# Altium schematic sheet CONNECTOR_EXP.SchDoc
size A3; SheetNumber: 4; SheetTotal: 23
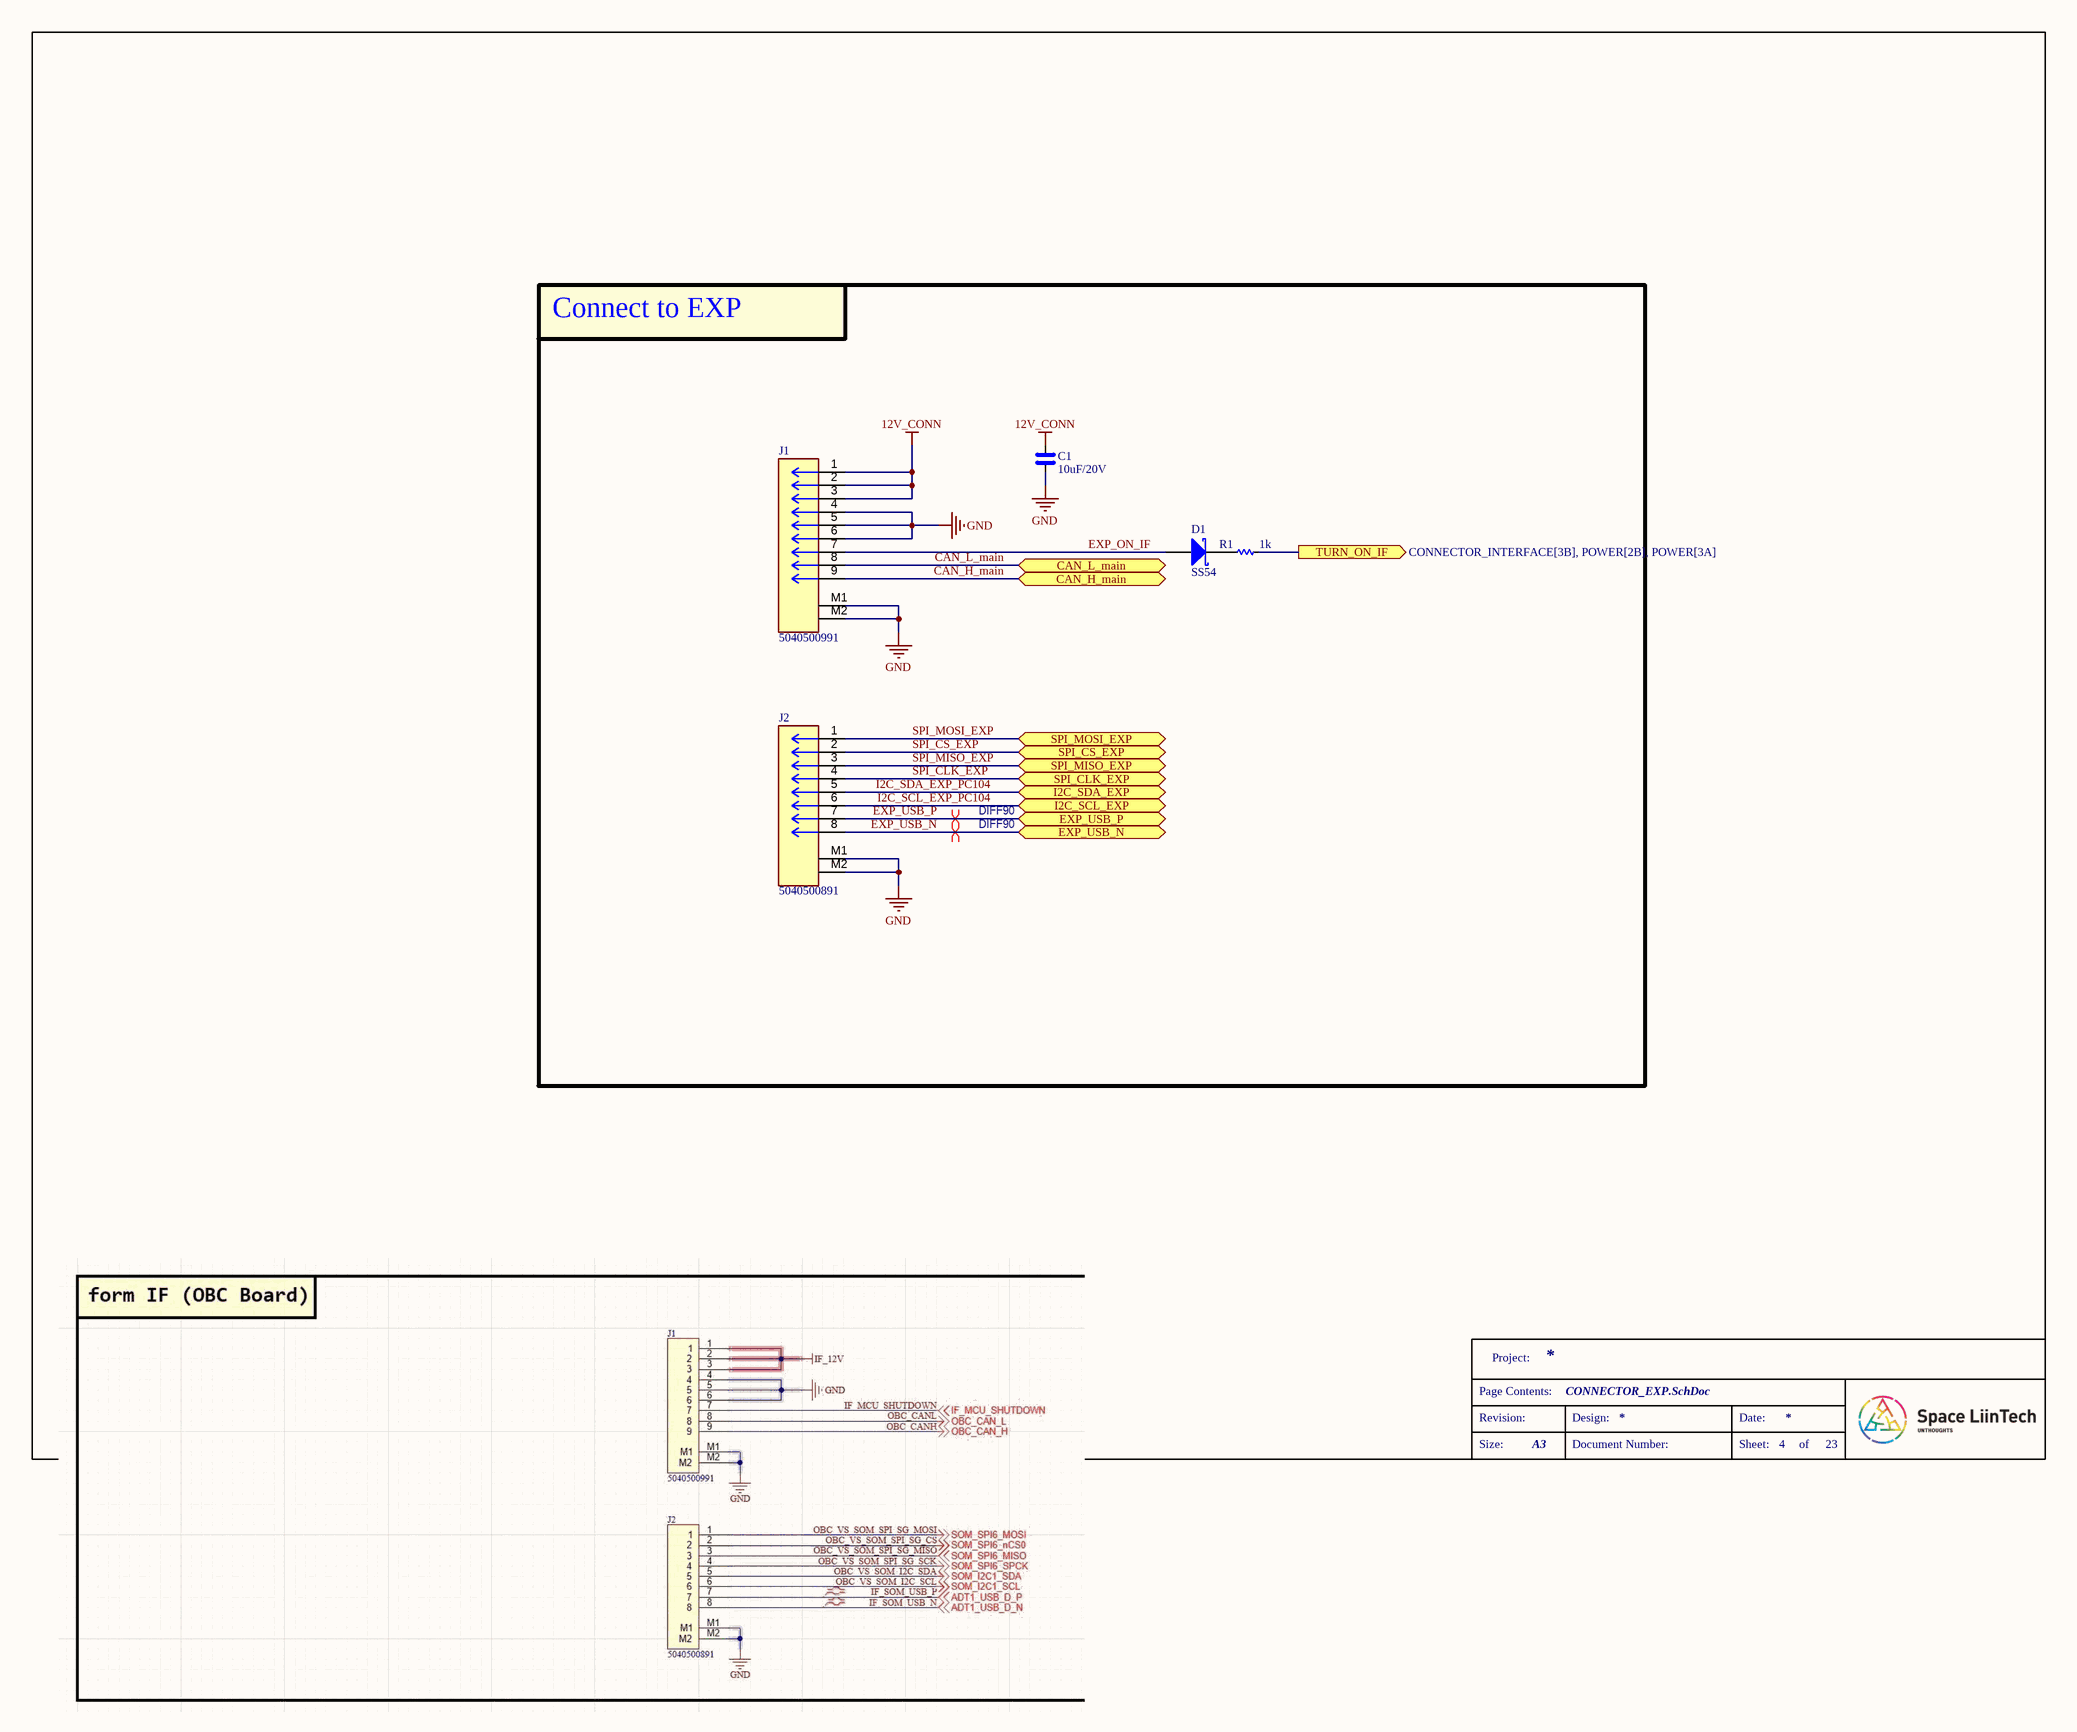
[diagram p0: CONNECTOR_EXP.SchDoc]

## Parts
C1  10uF/20V  [CAP_C_2012X110]
D1  SS54  [DO-214AC_SMA]
J1  5040500991  [MOLEX_5040500991]
J2  5040500891  [MOLEX_5040500891]
R1  1k  [RES_C_1005x30_L]

## Blocks framed on the sheet
Connect to EXP: C1 D1 J1 J2 R1

## Ports
CAN_H_main (bidir, see CAN_PHY[7A], CONNECTOR_INTERFACE[4A], CONNECTOR_INTERFACE[5C]), CAN_L_main (bidir, see CAN_PHY[7B], CONNECTOR_INTERFACE[4A], CONNECTOR_INTERFACE[7C]), EXP_USB_N (bidir, see CONNECTOR_INTERFACE[1C], SAMA7D65_MPU[4B]), EXP_USB_P (bidir, see CONNECTOR_INTERFACE[1C], SAMA7D65_MPU[4B]), I2C_SCL_EXP (bidir, see CONNECTOR_INTERFACE[1D], CONNECTOR_INTERFACE[6B], SAMA7D65_PIO[7A]), I2C_SDA_EXP (bidir, see CONNECTOR_INTERFACE[1C], CONNECTOR_INTERFACE[6B], SAMA7D65_PIO[7A]), SPI_CLK_EXP (bidir, see CONNECTOR_INTERFACE[3D], CONNECTOR_INTERFACE[4A]), SPI_CS_EXP (bidir, see CONNECTOR_INTERFACE[3C], CONNECTOR_INTERFACE[4A]), SPI_MISO_EXP (bidir, see CONNECTOR_INTERFACE[3D], CONNECTOR_INTERFACE[4A]), SPI_MOSI_EXP (bidir, see CONNECTOR_INTERFACE[3D], CONNECTOR_INTERFACE[4A]), TURN_ON_IF (out, see CONNECTOR_INTERFACE[3B], POWER[2B], POWER[3A])

## Nets
12V_CONN: C1.2 J1.1 J1.2 J1.3
GND: C1.1 J1.4 J1.5 J1.6 J1.M1 J1.M2 J2.M1 J2.M2
CAN_H_main: J1.9 ; port CAN_H_main
CAN_L_main: J1.8 ; port CAN_L_main
EXP_ON_IF: D1.1(A) J1.7
EXP_USB_N: J2.8 ; port EXP_USB_N
EXP_USB_P: J2.7 ; port EXP_USB_P
I2C_SCL_EXP_PC104: J2.6 ; port I2C_SCL_EXP
I2C_SDA_EXP_PC104: J2.5 ; port I2C_SDA_EXP
SPI_CLK_EXP: J2.4 ; port SPI_CLK_EXP
SPI_CS_EXP: J2.2 ; port SPI_CS_EXP
SPI_MISO_EXP: J2.3 ; port SPI_MISO_EXP
SPI_MOSI_EXP: J2.1 ; port SPI_MOSI_EXP
TURN_ON_IF: R1.2 ; port TURN_ON_IF
NetD1_2: D1.2(K) R1.1

## Layout directives
differential pair; differential pair class DIFF90; net class DIFF90; rule Matched Net Lengths [Tolerance = 4mil]: EXP_USB_N, EXP_USB_P

## Notes on the sheet
- Project:
- Page Contents:
- Revision:
- Design:
- Date:
- Size:
- A3
- Document Number:
- Sheet:
- of

## Library data of the parts
C1 = _CAP_C_High_2: CAP CHIP High Value
D1 = SS54: DIODE SCHOTTKY 40V 5A SMA; MPN: SS34; Solder: SMT; Value: SS34; MFR: *
J1 = 5040500991: Connector Header Surface Mount, Right Angle 9 position 0.059" (1.50mm)
J2 = 5040500891: Connector Header Surface Mount, Right Angle 8 position 0.059" (1.50mm)`
R1 = _RES_B_2: RES